# Altium schematic sheet Sheet4.SchDoc
size 420 x 297 mm; SheetNumber: 4; : ААЭД.468224.ххх Э3; PageSetup: Record=PageOptions|CenterHorizontal=True|CenterVertical=True|PrintScale=0.47|XCorrection=1.00|YCorrection=1.00|PrintKind=1|BorderSize=5000000|LeftOffset=0|BottomOffset=0|Orientation=1|PaperLength=1000|PaperWidth=1000|Scale=100|PaperSource=7|PrintQuality=-4|MediaType=1|DitherType=10|PrintScaleMode=1|PaperKind=A4; DecimalNumber: АЧАД.468224.ххх Э3; HeadOfSector: Нач. сектора; MainDevice: Перв.примен.; Name: Наименование; DecimalNumber_MIRROR: 3Э ххх.422864.ДАЧА
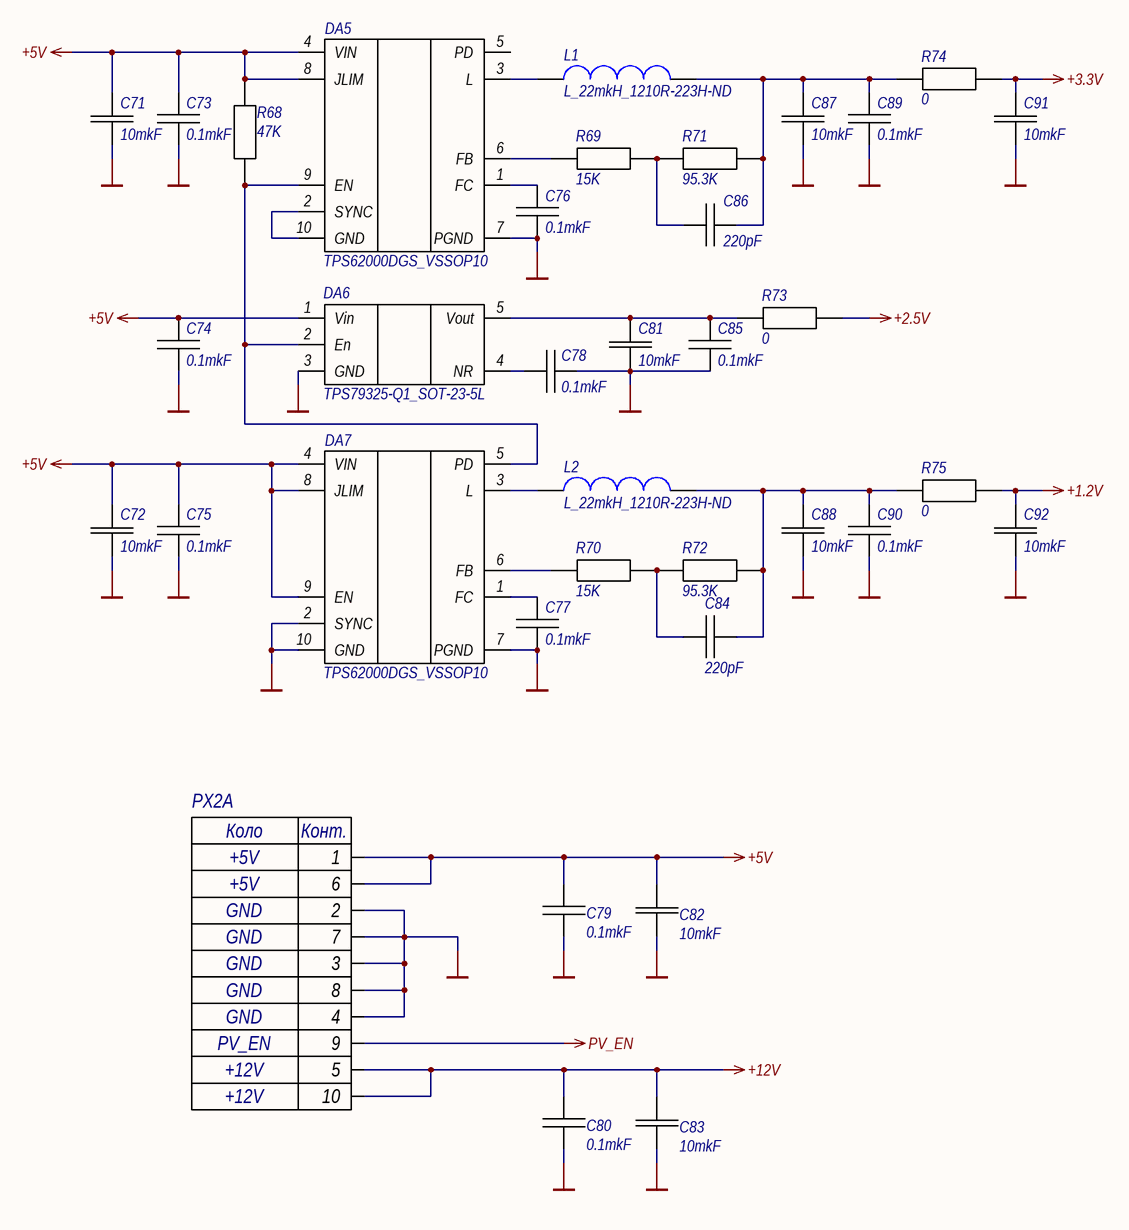
[diagram p0: Sheet4.SchDoc]

## Parts
C71  10mkF  [C_1206]
C72  10mkF  [C_1206]
C73  0.1mkF  [C_0603]
C74  0.1mkF  [C_0603]
C75  0.1mkF  [C_0603]
C76  0.1mkF  [C_0603]
C77  0.1mkF  [C_0603]
C78  0.1mkF  [C_0603]
C79  0.1mkF  [C_0603]
C80  0.1mkF  [C_0603]
C81  10mkF  [C_1206]
C82  10mkF  [C_1206]
C83  10mkF  [C_1206]
C84  220pF  [C_0603]
C85  0.1mkF  [C_0603]
C86  220pF  [C_0603]
C87  10mkF  [C_1206]
C88  10mkF  [C_1206]
C89  0.1mkF  [C_0603]
C90  0.1mkF  [C_0603]
C91  10mkF  [C_1206]
C92  10mkF  [C_1206]
DA5  TPS62000DGS_VSSOP10  [THS4130IDGK(MSOP8)]
DA6  TPS79325-Q1_SOT-23-5L  [SOT95P280X110-5N]
DA7  TPS62000DGS_VSSOP10  [THS4130IDGK(MSOP8)]
L1  L_22mkH_1210R-223H-ND  [1210R_IND]
L2  L_22mkH_1210R-223H-ND  [1210R_IND]
PX2  M80-5101042  (value not drawn)  (parts A,B,C,D,E,F,G,H,I,J of 10)
R68  47K  [R_1206]
R69  15K  [R_1206]
R70  15K  [R_1206]
R71  95.3K  [R_1206]
R72  95.3K  [R_1206]
R73  0  [R_1206]
R74  0  [R_1206]
R75  0  [R_1206]

## Nets
+1.2V: C92.2 R75.1
+2.5V: R73.1
+3.3V: C91.2 R74.1
+5V: C71.2 C72.2 C73.1 C74.1 C75.1 C79.1 C82.2 DA5.4(VIN) DA5.8(JLIM) DA6.1(Vin) DA7.4(VIN) DA7.8(JLIM) DA7.9(EN) PX2.1 PX2.6 R68.1
+12V: C80.1 C83.2 PX2.5 PX2.10
GND: C71.1 C72.1 C73.2 C74.2 C75.2 C76.2 C77.2 C78.1 C79.2 C80.2 C81.1 C82.1 C83.1 C85.2 C87.1 C88.1 C89.2 C90.2 C91.1 C92.1 DA5.7(PGND) DA6.3(GND) DA7.2(SYNC) DA7.7(PGND) DA7.10(GND) PX2.2 PX2.3 PX2.4 PX2.7 PX2.8
PV_EN: PX2.9
NetC76_1: C76.1 DA5.1(FC)
NetC77_1: C77.1 DA7.1(FC)
NetC78_2: C78.2 DA6.4(NR)
NetC81_2: C81.2 C85.1 DA6.5(Vout) R73.2
NetC84_1: C84.1 R70.1 R72.1
NetC84_2: C84.2 C88.2 C90.1 L2.2 R72.2 R75.2
NetC86_1: C86.1 R69.1 R71.1
NetC86_2: C86.2 C87.2 C89.1 L1.2 R71.2 R74.2
NetDA5_2: DA5.2(SYNC) DA5.10(GND)
NetDA5_3: DA5.3(L) L1.1
NetDA5_6: DA5.6(FB) R69.2
NetDA5_9: DA5.9(EN) DA6.2(En) DA7.5(PD) R68.2
NetDA7_3: DA7.3(L) L2.1
NetDA7_6: DA7.6(FB) R70.2

Not connected (* = marked no-connect by the designer): DA5 5(PD)

## Notes on the sheet
- Коло
- +5V
- (near PX2) Конт.
- GND
- PV_EN
- +12V
- Подп. и дата
- Инв.№ дубл.
- Взам.инв.№
- Подп.и дата
- Инв.№ подл.
- Изм.
- Лист
- № докум.
- Подп.
- Дата
- Формат  A3

## Library data of the parts
C71 C72 C81-C83 C87 C88 C91 C92 = C_10mkF_1206: Value: 10mkF
C73-C80 C84-C86 C89 C90 = C_0.1mkF_0603
  C73-C80 C85 C89 C90: Value: 0.1mkF
  C84 C86: Value: 220pF
R68-R75 = R_10_1206
  R68: Value: 47K
  R69 R70: Value: 15K
  R71 R72: Value: 95.3K
  R73-R75: Value: 0